# Altium schematic sheet S8050_C1054331_S8050_C105433.schdoc
size 127 x 101 mm
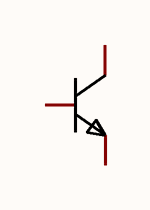
[diagram p0: S8050_C1054331_S8050_C105433.schdoc]

## Parts
Q?  S8050_C105433  [SOT-23-3_L2.9-W1.6-P1.90-LS2.8-BR]  (value not drawn)

## Nets

Not connected (* = marked no-connect by the designer): Q? 1 2 3

## Library data of the parts
Q? = S8050_C105433: Manufacturer: CJ(江苏长电/长晶); Name: S8050; Add into BOM: yes; Transistor Type: NPN; Collector-Emitter Breakdown Voltage (Vceo): 25V; Collector Current (Ic): 500mA; Power Dissipation (Pd): 300mW; Collector Cut-Off Current (Icbo): 100nA; Collector-Emitter Saturation Voltage (VCE(sat)@Ic,Ib): 600mV@500mA,50mA; DC Current Gain (hFE@Ic,Vce): 120@50mA,1V; Transition Frequency (fT): 150MHz; Symbol: S8050_C105433; Device: S8050_C105433; LCSC Part Name: NPN 25V 500mA L档 120-200; Supplier Part: C105433; Manufacturer Part: S8050; Supplier Footprint: SOT-23-3L; JLCPCB Part Class: Extended Part; Datasheet: https://atta.szlcsc.com/upload/public/pdf/source/20170415/1492237762328.pdf; Supplier: LCSC; Convert to PCB: yes; Operating Temperature: +150℃@(Tj)